# Altium schematic sheet MAX5875_4.SchDoc
size A; SheetNumber: 17; SheetTotal: 24
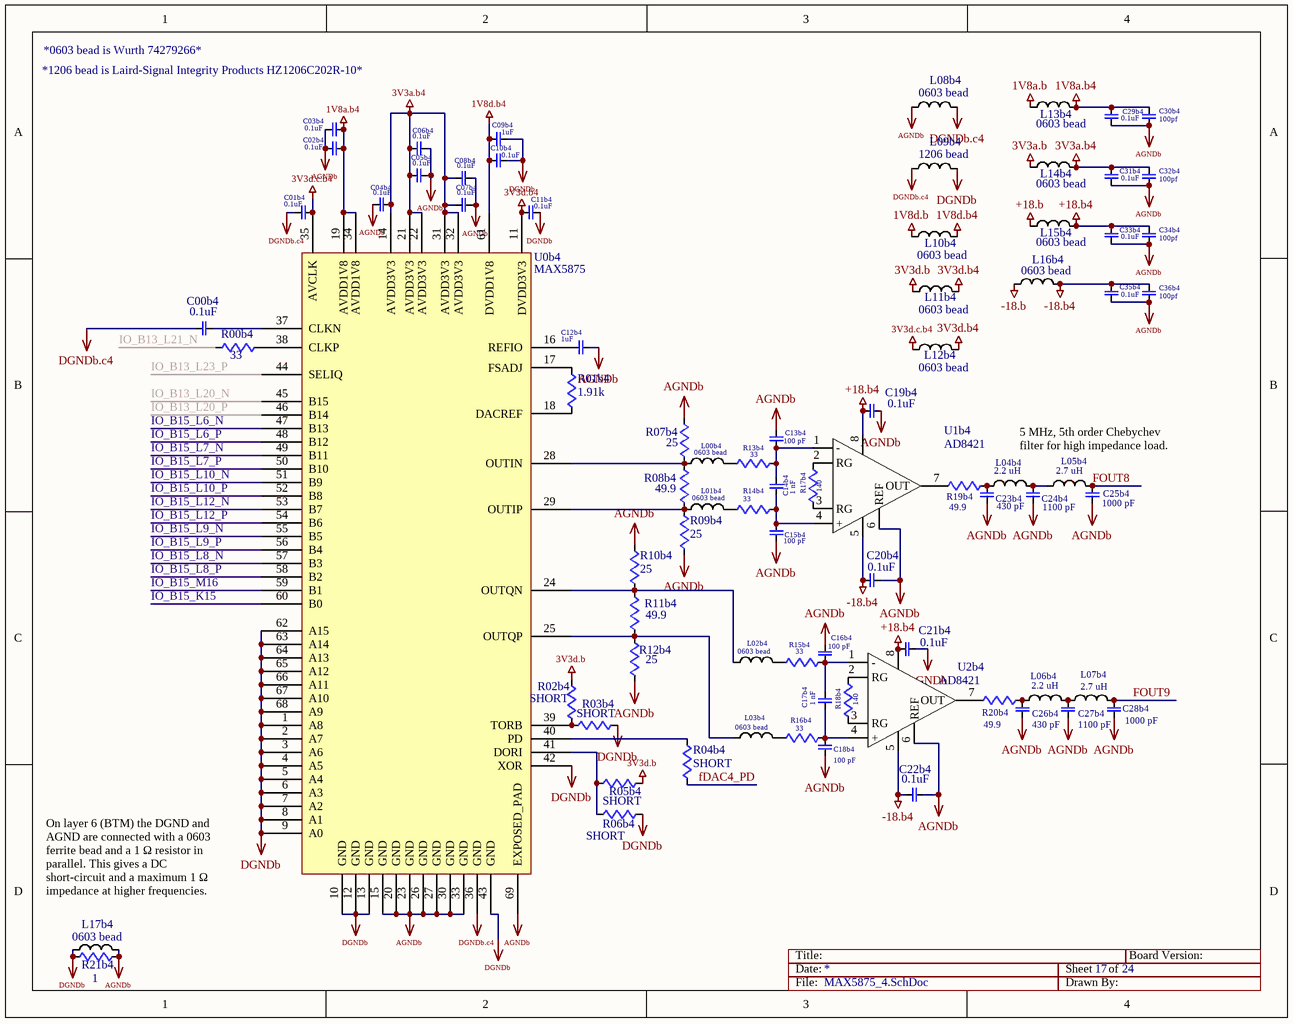
[diagram p0: MAX5875_4.SchDoc]

## Parts
C00b4  0.1uF  [0402]
C01b4  0.1uF  [0402]
C02b4  0.1uF  [0402]
C03b4  0.1uF  [0402]
C04b4  0.1uF  [0402]
C05b4  0.1uF  [0402]
C06b4  0.1uF  [0402]
C07b4  0.1uF  [0402]
C08b4  0.1uF  [0402]
C09b4  1uF  [0603]
C10b4  0.1uF  [0402]
C11b4  0.1uF  [0402]
C12b4  1uF  [0402]
C13b4  100 pF  [0603]
C14b4  1 nF  [0603]
C15b4  100 pF  [0603]
C16b4  100 pF  [0603]
C17b4  1 nF  [0603]
C18b4  100 pF  [0603]
C19b4  0.1uF  [0603]
C20b4  0.1uF  [0603]
C21b4  0.1uF  [0603]
C22b4  0.1uF  [0603]
C23b4  430 pF  [0603]
C24b4  1100 pF  [0603]
C25b4  1000 pF  [0603]
C26b4  430 pF  [0603]
C27b4  1100 pF  [0603]
C28b4  1000 pF  [0603]
C29b4  0.1uF  [0603]
C30b4  100pf  [0603]
C31b4  0.1uF  [0603]
C32b4  100pf  [0603]
C33b4  0.1uF  [0603]
C34b4  100pf  [0603]
C35b4  0.1uF  [0603]
C36b4  100pf  [0603]
L00b4  0603 bead  [0603]
L01b4  0603 bead  [0603]
L02b4  0603 bead  [0603]
L03b4  0603 bead  [0603]
L04b4  2.2 uH  [0603]
L05b4  2.7 uH  [0603]
L06b4  2.2 uH  [0603]
L07b4  2.7 uH  [0603]
L08b4  0603 bead  [0603]
L09b4  1206 bead  [1206]
L10b4  0603 bead  [0603]
L11b4  0603 bead  [0603]
L12b4  0603 bead  [0603]
L13b4  0603 bead  [0603]
L14b4  0603 bead  [0603]
L15b4  0603 bead  [0603]
L16b4  0603 bead  [0603]
L17b4  0603 bead  [0603]
R00b4  33  [0402]
R01b4  1.91k  [0603]
R02b4  SHORT  [0603]
R03b4  SHORT  [0603]
R04b4  SHORT  [0603]
R05b4  SHORT  [0603]
R06b4  SHORT  [0603]
R07b4  25  [0603]
R08b4  49.9  [0603]
R09b4  25  [0603]
R10b4  25  [0603]
R11b4  49.9  [0603]
R12b4  25  [0603]
R13b4  33  [0603]
R14b4  33  [0603]
R15b4  33  [0603]
R16b4  33  [0603]
R17b4  140  [0402]
R18b4  140  [0402]
R19b4  49.9  [0603]
R20b4  49.9  [0603]
R21b4  1  [0603]
U0b4  MAX5875  [68LQFN]
U1b4  AD8421  [8SOIC]
U2b4  AD8421  [8SOIC]

## Nets
1V8a.b: L13b4.1
1V8a.b4: C02b4.1 C03b4.2 C29b4.1 C30b4.1 L13b4.2 U0b4.19(AVDD1V8) U0b4.34(AVDD1V8)
1V8d.b: L10b4.1
1V8d.b4: C09b4.2 C10b4.2 L10b4.2 U0b4.61(DVDD1V8)
3V3a.b: L14b4.1
3V3a.b4: C04b4.1 C05b4.2 C06b4.1 C07b4.2 C08b4.1 C31b4.1 C32b4.1 L14b4.2 U0b4.14(AVDD3V3) U0b4.21(AVDD3V3) U0b4.22(AVDD3V3) U0b4.31(AVDD3V3) U0b4.32(AVDD3V3)
3V3d.b: L11b4.1 R02b4.2 R05b4.2
3V3d.b4: C11b4.2 L11b4.2 L12b4.2 U0b4.11(DVDD3V3)
3V3d.c.b4: C01b4.1 L12b4.1 U0b4.35(AVCLK)
+18.b: L15b4.1
+18.b4: C19b4.2 C21b4.2 C33b4.1 C34b4.1 L15b4.2 U1b4.8(+VS) U2b4.8(+VS)
-18.b: L16b4.1
-18.b4: C20b4.2 C22b4.2 C35b4.1 C36b4.1 L16b4.2 U1b4.5(-VS) U2b4.5(-VS)
AGNDb: C02b4.2 C03b4.1 C04b4.2 C05b4.1 C06b4.2 C07b4.1 C08b4.2 C12b4.1 C13b4.1 C15b4.1 C16b4.1 C18b4.1 C19b4.1 C20b4.1 C21b4.1 C22b4.1 C23b4.2 C24b4.2 C25b4.2 C26b4.2 C27b4.2 C28b4.2 C29b4.2 C30b4.2 C31b4.2 C32b4.2 C33b4.2 C34b4.2 C35b4.2 C36b4.2 L08b4.1 L17b4.2 R07b4.2 R09b4.1 R10b4.2 R12b4.1 R21b4.1 U0b4.15(GND) U0b4.20(GND) U0b4.23(GND) U0b4.26(GND) U0b4.27(GND) U0b4.30(GND) U0b4.33(GND) U0b4.69(EXPOSED_PAD) U1b4.6(REF) U2b4.6(REF)
DGNDb: C09b4.1 C10b4.1 C11b4.1 L09b4.2 L17b4.1 R03b4.2 R06b4.2 R21b4.2 U0b4.1(A8) U0b4.2(A7) U0b4.3(A6) U0b4.4(A5) U0b4.5(A4) U0b4.6(A3) U0b4.7(A2) U0b4.8(A1) U0b4.9(A0) U0b4.10(GND) U0b4.12(GND) U0b4.13(GND) U0b4.42(XOR) U0b4.43(GND) U0b4.62(A15) U0b4.63(A14) U0b4.64(A13) U0b4.65(A12) U0b4.66(A11) U0b4.67(A10) U0b4.68(A9)
DGNDb.c4: C00b4.2 C01b4.2 L08b4.2 L09b4.1 U0b4.36(GND)
fDAC4_PD: R04b4.2
FOUT8: C25b4.1 L05b4.2
FOUT9: C28b4.1 L07b4.2
IO_B13_L20_N: U0b4.45(B15)
IO_B13_L20_P: U0b4.46(B14)
IO_B13_L21_N: R00b4.1
IO_B13_L23_P: U0b4.44(SELIQ)
IO_B15_K15: U0b4.60(B0)
IO_B15_L6_N: U0b4.47(B13)
IO_B15_L6_P: U0b4.48(B12)
IO_B15_L7_N: U0b4.49(B11)
IO_B15_L7_P: U0b4.50(B10)
IO_B15_L8_N: U0b4.57(B3)
IO_B15_L8_P: U0b4.58(B2)
IO_B15_L9_N: U0b4.55(B5)
IO_B15_L9_P: U0b4.56(B4)
IO_B15_L10_N: U0b4.51(B9)
IO_B15_L10_P: U0b4.52(B8)
IO_B15_L12_N: U0b4.53(B7)
IO_B15_L12_P: U0b4.54(B6)
IO_B15_M16: U0b4.59(B1)
NetC00b4_1: C00b4.1 U0b4.37(CLKN)
NetC12b4_2: C12b4.2 U0b4.16(REFIO)
NetC13b4_2: C13b4.2 C14b4.1 R13b4.1 U1b4.1(-)
NetC14b4_2: C14b4.2 C15b4.2 R14b4.1 U1b4.4(+)
NetC16b4_2: C16b4.2 C17b4.1 R15b4.1 U2b4.1(-)
NetC17b4_2: C17b4.2 C18b4.2 R16b4.1 U2b4.4(+)
NetC23b4_1: C23b4.1 L04b4.1 R19b4.2
NetC24b4_1: C24b4.1 L04b4.2 L05b4.1
NetC26b4_1: C26b4.1 L06b4.1 R20b4.2
NetC27b4_1: C27b4.1 L06b4.2 L07b4.1
NetL00b4_1: L00b4.1 R07b4.1 R08b4.2 U0b4.28(OUTIN)
NetL00b4_2: L00b4.2 R13b4.2
NetL01b4_1: L01b4.1 R08b4.1 R09b4.2 U0b4.29(OUTIP)
NetL01b4_2: L01b4.2 R14b4.2
NetL02b4_1: L02b4.1 R10b4.1 R11b4.2 U0b4.24(OUTQN)
NetL02b4_2: L02b4.2 R15b4.2
NetL03b4_1: L03b4.1 R11b4.1 R12b4.2 U0b4.25(OUTQP)
NetL03b4_2: L03b4.2 R16b4.2
NetR00b4_2: R00b4.2 U0b4.38(CLKP)
NetR01b4_1: R01b4.1 U0b4.18(DACREF)
NetR01b4_2: R01b4.2 U0b4.17(FSADJ)
NetR02b4_1: R02b4.1 R03b4.1 U0b4.39(TORB)
NetR04b4_1: R04b4.1 U0b4.40(PD)
NetR05b4_1: R05b4.1 R06b4.1 U0b4.41(DORI)
NetR17b4_1: R17b4.1 U1b4.3(RG)
NetR17b4_2: R17b4.2 U1b4.2(RG)
NetR18b4_1: R18b4.1 U2b4.3(RG)
NetR18b4_2: R18b4.2 U2b4.2(RG)
NetR19b4_1: R19b4.1 U1b4.7(OUT)
NetR20b4_1: R20b4.1 U2b4.7(OUT)

## Notes on the sheet
- *1206 bead is Laird-Signal Integrity Products HZ1206C202R-10*
- *0603 bead is Wurth 74279266*
- 5 MHz, 5th order Chebychev filter for high impedance load.
- On layer 6 (BTM) the DGND and AGND are connected with a 0603 ferrite bead and a 1 Ω resistor in parallel. This gives a DC short-circuit and a maximum 1 Ω impedance at higher frequencies.
- Title:
- Date:
- Sheet
- of
- Board Version:
- File:
- Drawn By:

## Library data of the parts
C00b4 C01b4 C02b4 C03b4 C04b4 C05b4 C06b4 C07b4 C08b4 C09b4 C10b4 C11b4 C12b4 C13b4 C14b4 C15b4 C16b4 C17b4 C18b4 C19b4 C20b4 C21b4 C22b4 C23b4 C24b4 C25b4 C26b4 C27b4 C28b4 C29b4 C30b4 C31b4 C32b4 C33b4 C34b4 C35b4 C36b4 = CAP
L00b4 L01b4 L02b4 L03b4 L04b4 L05b4 L06b4 L07b4 L08b4 L09b4 L10b4 L11b4 L12b4 L13b4 L14b4 L15b4 L16b4 L17b4 = INDUCTOR
R00b4 R01b4 R02b4 R03b4 R04b4 R05b4 R06b4 R07b4 R08b4 R09b4 R10b4 R11b4 R12b4 R13b4 R14b4 R15b4 R16b4 R17b4 R18b4 R19b4 R20b4 R21b4 = RES